# EAGLE design mindspy (EAGLE 6.4)
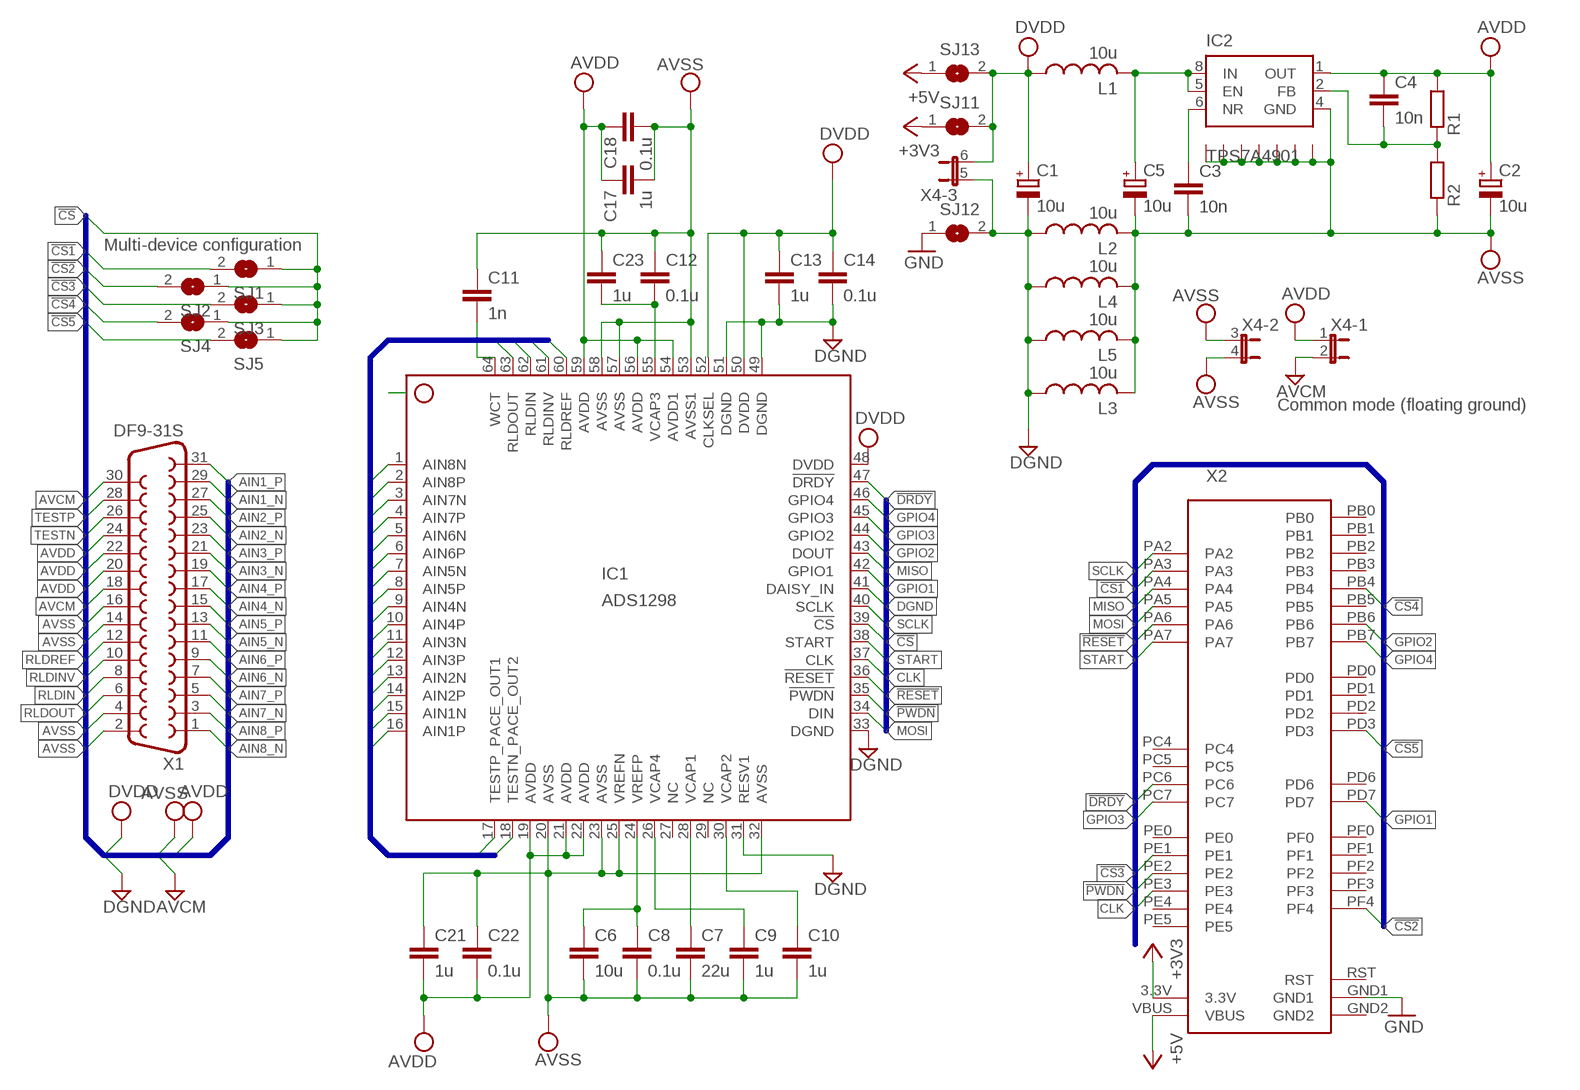
[diagram p0: schematic, sheet 1]

## Parts
C1  10u  CPOL-EUSMCA  [SMC_A]
C2  10u  CPOL-EUSMCA  [SMC_A]
C3  10n  C-EUC0603  [C0603]
C4  10n  C-EUC0603  [C0603]
C5  10u  CPOL-EUSMCA  [SMC_A]
C6  10u  C-EUC0805  [C0805]
C7  22u  C-EUC0805  [C0805]
C8  0.1u  C-EUC0402  [C0402]
C9  1u  C-EUC0402  [C0402]
C10  1u  C-EUC0402  [C0402]
C11  1n  C-EUC0402  [C0402]
C12  0.1u  C-EUC0402  [C0402]
C13  1u  C-EUC0402  [C0402]
C14  0.1u  C-EUC0402  [C0402]
C17  1u  C-EUC0402  [C0402]
C18  0.1u  C-EUC0402  [C0402]
C21  1u  C-EUC0402  [C0402]
C22  0.1u  C-EUC0402  [C0402]
C23  1u  C-EUC0402  [C0402]
IC1  ADS1298  [HTQFP-64-PAP]
IC2  TPS7A4901  [MSOP08]
L1  10u  L1210  [L1210K]
L2  10u  L1210  [L1210K]
L3  10u  L1210  [L1210K]
L4  10u  L1210  [L1210K]
L5  10u  L1210  [L1210K]
R1  R-EU_R0402  [R0402]
R2  R-EU_R0402  [R0402]
SJ1  SJ  [SJ]
SJ2  SJ  [SJ]
SJ3  SJ  [SJ]
SJ4  SJ  [SJ]
SJ5  SJ  [SJ]
SJ11  SJ  [SJ]
SJ12  SJ  [SJ]
SJ13  SJ  [SJ]
X1  DF9-31S  [DF9-31S]
X2  STELLARIS-LAUNCHPADSTELLARIS-LAUNCHPAD  [LAUNCHPAD-XL]
X4  JP3QE  [JP3Q]

## Nets
!CS: IC1.39(!CS) SJ1.1 SJ2.1 SJ3.1 SJ4.1 SJ5.1
!CS1: SJ1.2 X2.PA3
!CS2: SJ2.2 X2.PF4
!CS3: SJ3.2 X2.PE1
!CS4: SJ4.2 X2.PB4
!CS5: SJ5.2 X2.PD3
!DRDY: IC1.47(!DRDY) X2.PC6
!PWDN: IC1.35(!PWDN) X2.PE2
!RESET: IC1.36(!RESET) X2.PA6
+3V3: SJ11.1 X2.3.3V
+5V: SJ13.1 X2.VBUS
AIN1_N: IC1.15(AIN1N) X1.29
AIN1_P: IC1.16(AIN1P) X1.31
AIN2_N: IC1.13(AIN2N) X1.25
AIN2_P: IC1.14(AIN2P) X1.27
AIN3_N: IC1.11(AIN3N) X1.21
AIN3_P: IC1.12(AIN3P) X1.23
AIN4_N: IC1.9(AIN4N) X1.17
AIN4_P: IC1.10(AIN4P) X1.19
AIN5_N: IC1.7(AIN5N) X1.13
AIN5_P: IC1.8(AIN5P) X1.15
AIN6_N: IC1.5(AIN6N) X1.9
AIN6_P: IC1.6(AIN6P) X1.11
AIN7_N: IC1.3(AIN7N) X1.5
AIN7_P: IC1.4(AIN7P) X1.7
AIN8_N: IC1.1(AIN8N) X1.1
AIN8_P: IC1.2(AIN8P) X1.3
AVCM: X1.18 X1.30 X4.2
AVDD: C2.+ C4.1 C17.1 C18.1 C21.2 C22.2 IC1.19(AVDD) IC1.21(AVDD) IC1.22(AVDD) IC1.54(AVDD1) IC1.56(AVDD) IC1.59(AVDD) IC2.1(OUT) R1.2 X1.20 X1.22 X1.24 X4.1
AVSS: C2.- C3.2 C5.- C6.2 C7.2 C8.2 C9.2 C10.2 C11.1 C12.1 C17.2 C18.2 C21.1 C22.1 C23.1 IC1.20(AVSS) IC1.23(AVSS) IC1.25(VREFN) IC1.32(AVSS) IC1.53(AVSS1) IC1.57(AVSS) IC1.58(AVSS) IC2.4(GND) IC2.NC@0(GND) IC2.NC@1(GND) IC2.NC@2(GND) IC2.NC@3(GND) IC2.NC@4(GND) IC2.PWR@1(GND) IC2.PWR@2(GND) L2.2 L3.2 L4.2 L5.2 R2.1 X1.2 X1.4 X1.14 X1.16 X4.3 X4.4
CLK: IC1.37(CLK) X2.PE3
DGND: C1.- C13.2 C14.2 IC1.31(RESV1) IC1.33(DGND) IC1.41(DAISY_IN) IC1.49(DGND) IC1.51(DGND) L2.1 L3.1 L4.1 L5.1 SJ12.2 X4.5
DVDD: C1.+ C13.1 C14.1 IC1.48(DVDD) IC1.50(DVDD) IC1.52(CLKSEL) L1.1 SJ11.2 SJ13.2 X4.6
GND: SJ12.1 X2.GND1
GPIO1: IC1.42(GPIO1) X2.PD7
GPIO2: IC1.44(GPIO2) X2.PB6
GPIO3: IC1.45(GPIO3) X2.PC7
GPIO4: IC1.46(GPIO4) X2.PB7
MISO: IC1.43(DOUT) X2.PA4
MOSI: IC1.34(DIN) X2.PA5
N$1: C6.1 C8.1 IC1.24(VREFP)
N$2: C7.1 IC1.28(VCAP1)
N$3: C3.1 IC2.6(NR)
N$4: C9.1 IC1.26(VCAP4)
N$5: C10.1 IC1.30(VCAP2)
N$6: C12.2 C23.2 IC1.55(VCAP3)
N$7: C11.2 IC1.64(WCT)
N$19: C4.2 IC2.2(FB) R1.1 R2.2
N$22: C5.+ IC2.5(EN) IC2.8(IN) L1.2
RLDIN: IC1.62(RLDIN) X1.8
RLDINV: IC1.61(RLDINV) X1.10
RLDOUT: IC1.63(RLDOUT) X1.6
RLDREF: IC1.60(RLDREF) X1.12
SCLK: IC1.40(SCLK) X2.PA2
START: IC1.38(START) X2.PA7
TESTN: IC1.18(TESTN_PACE_OUT2) X1.26
TESTP: IC1.17(TESTP_PACE_OUT1) X1.28
Unconnected: IC1.27(NC) IC1.29(NC) X2.PB0 X2.PB1 X2.PB2 X2.PB3 X2.PB5 X2.PC4 X2.PC5 X2.PD0 X2.PD1 X2.PD2 X2.PD6 X2.PE0 X2.PE4 X2.PE5 X2.PF0 X2.PF1 X2.PF2 X2.PF3

## Buses
BUS

## Notes on the sheet
- Multi-device configuration
- Common mode (floating ground)

## Power pins joined to a net without a drawn wire
GND2: X2.GND2
RST: X2.RST

## Library data of the parts
C1 C2 C5 = rcl:CPOL-EU: POLARIZED CAPACITOR, European symbol
C3 C4 C6-C14 C17 C18 C21-C23 = rcl:C-EU: CAPACITOR, European symbol
IC1 = fabhack:ADS1298: Quad/Octal, Simultaneous Sampling, 24-Bit Analog-to-Digital Converters ADS1294 / ADS1298 Source: http://focus.ti.com/lit/ds/symlink/ads1294.pdf; MPN: ADS1294IPAG
IC2 = fabhack:TPS7A49*: Ultralow-Noise, Positive LINEAR REGULATOR, +36V, +150mA WITH 8-PIN PSOP PACKAGING Source: http://www.ti.com/lit/ds/symlink/tps7a4901.pdf
L1-L5 = fabhack:L1210
R1 R2 = rcl:R-EU_: RESISTOR, European symbol
SJ1-SJ5 SJ11-SJ13 = jumper:SJ: SMD solder JUMPER
X1 = con-hirose:DF9-31S: SMD CONNECTOR Source: con-hirose.lbr from Bob Starr <rtzaudio@mindspring.com>; MPN: DF9-31S-1V(32); OC_FARNELL: 1798382; OC_NEWARK: 74R3383
X2 = fabhack:STELLARIS-LAUNCHPAD: Stellaris Launchpad LM4F120 using all header pins to connect to XL booster packs.
X4 = jumper:JP3QE: JUMPER

## Board
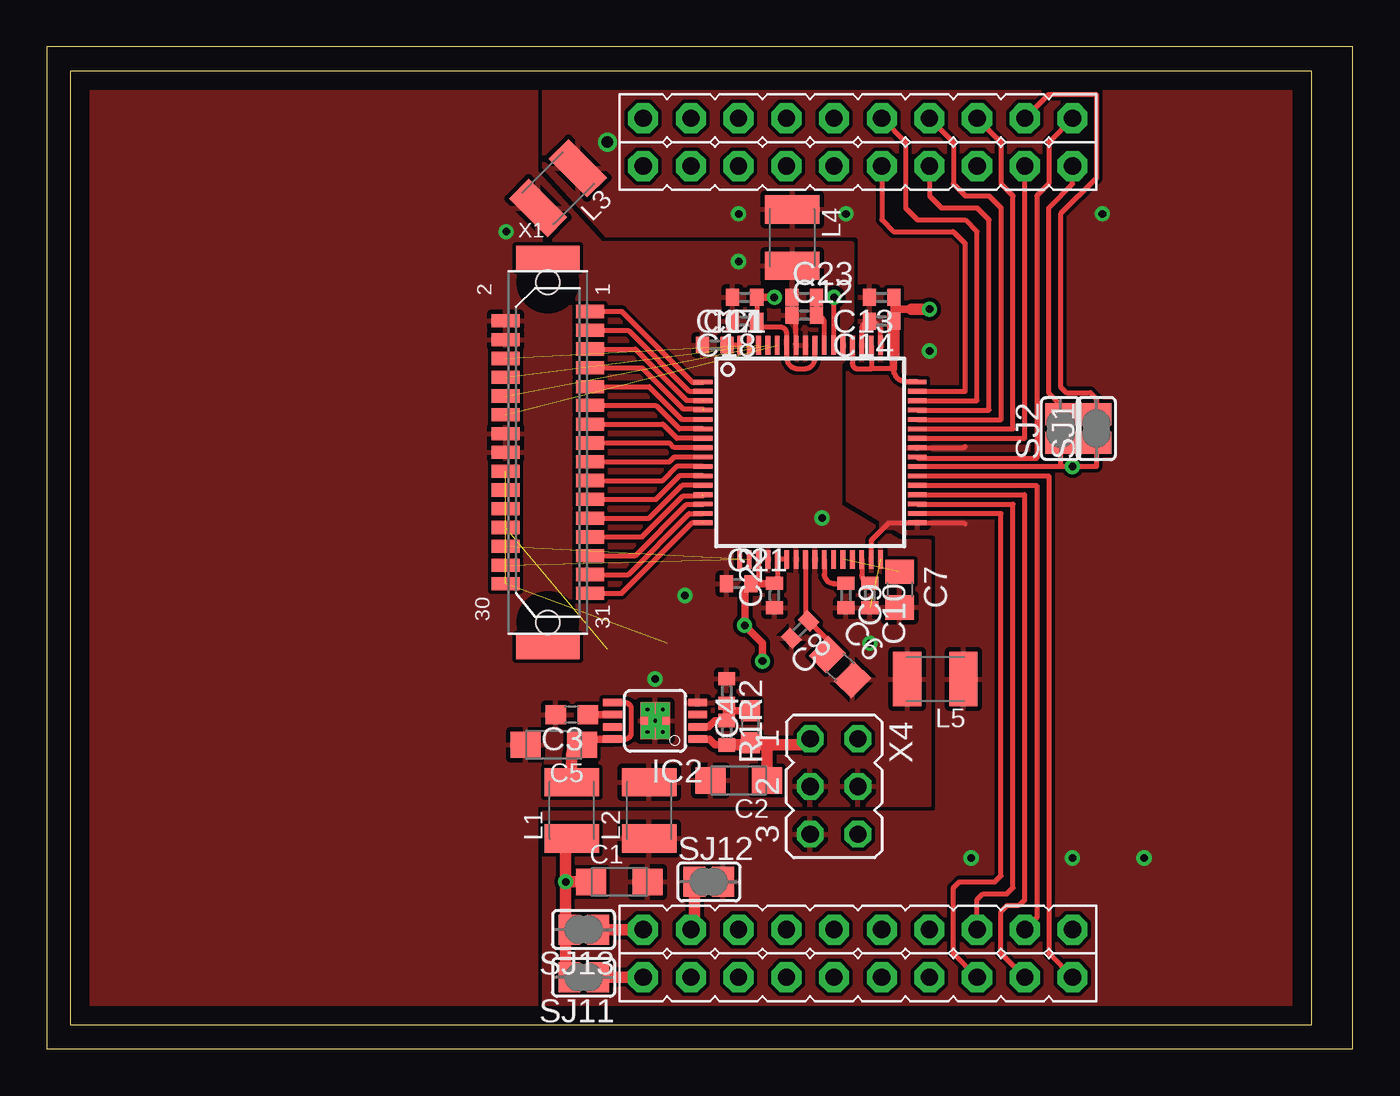
[diagram p1: board, top side]
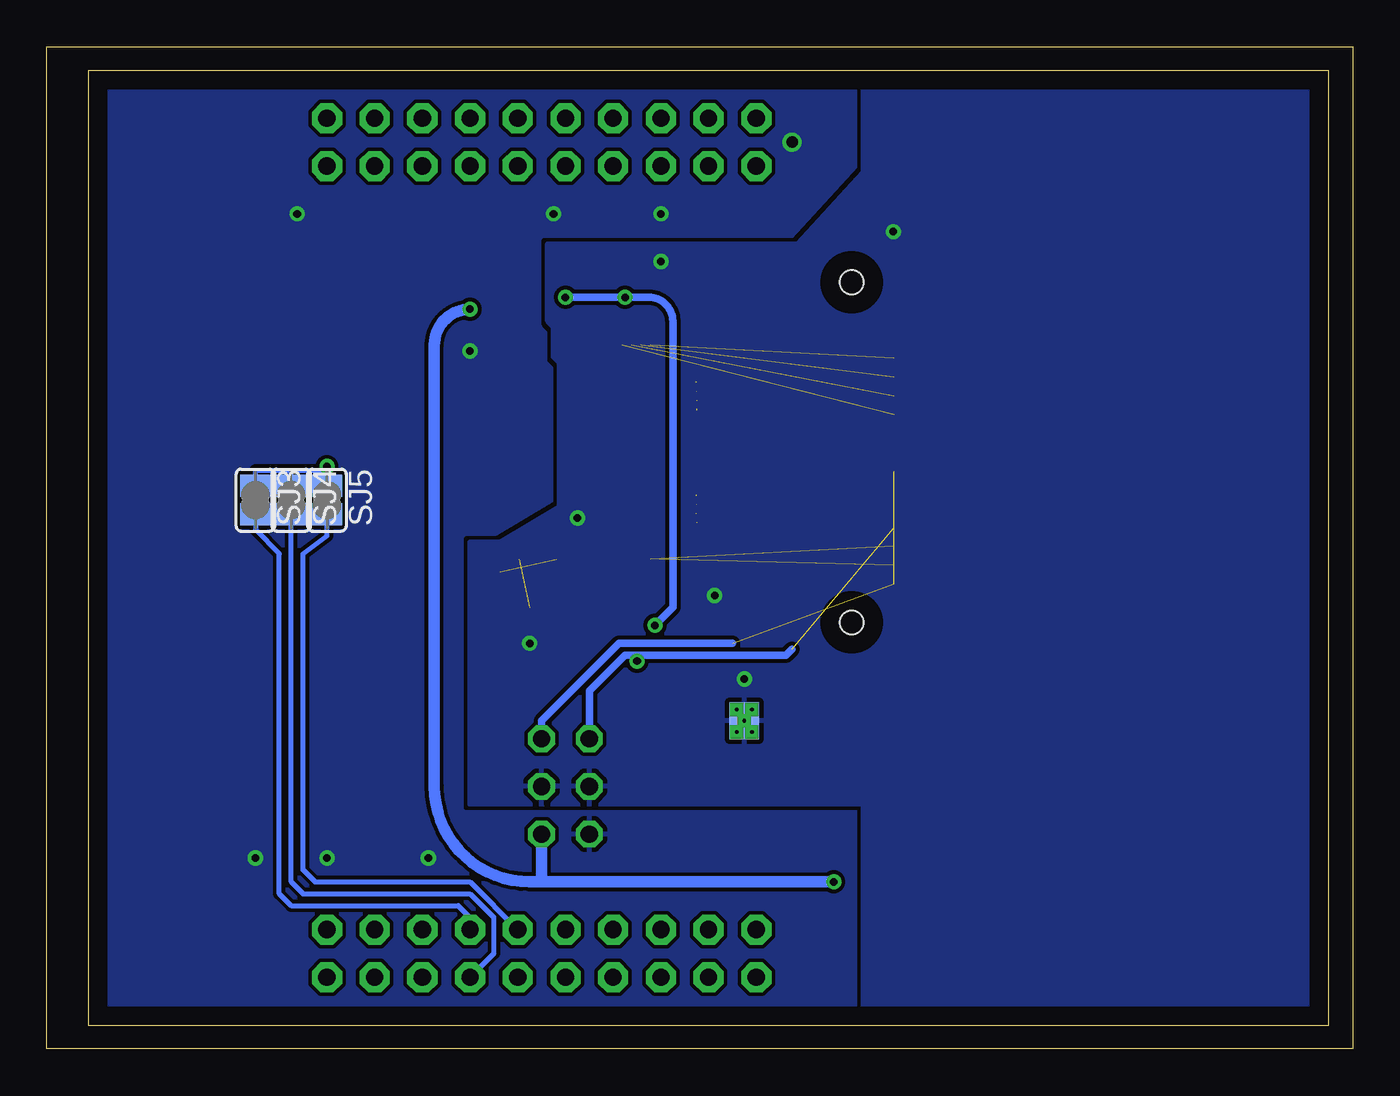
[diagram p2: board, bottom side, seen from below]

Size 69.52 x 53.33 mm. Coordinates in mm from the lower left corner, seen from the top.
Outline: 0,0 69.52,0 69.52,53.33 0,53.33 0,0
Copper layers (1*16): Top 0.035mm / dielectric 1.5mm / Bottom 0.035mm
Design rules "default *": minimum track width 1mil, minimum drill 24mil, track to track 8mil, track to pad 8mil, pad to pad 8mil, via to via 8mil, smd to smd 8mil, copper to edge 40mil, drill to drill 8mil, minimum pad ring 10mil, minimum via ring 8mil, stop-mask expansion 4mil, vias tented up to drill 0mil, thermal gap 10mil

### Footprints (pad centres in the part's own frame; a part is rotated, then mirrored left to right if it is on the bottom)
SMC_A = smd 1.6 x 1.4: + -1.5,0; - 1.5,0
C0603 = smd 1.1 x 1: 1 -0.85,0; 2 0.85,0
C0805 = smd 1.3 x 1.5: 1 -0.95,0; 2 0.95,0
C0402 = smd 0.7 x 0.9: 1 -0.65,0; 2 0.65,0
HTQFP-64-PAP = smd 1 x 0.25: 1 -5.7,3.75; 2 -5.7,3.25; 3 -5.7,2.75; 4 -5.7,2.25; 5 -5.7,1.75; 6 -5.7,1.25; 7 -5.7,0.75; 8 -5.7,0.25; 9 -5.7,-0.25; 10 -5.7,-0.75; 11 -5.7,-1.25; 12 -5.7,-1.75; 13 -5.7,-2.25; 14 -5.7,-2.75; 15 -5.7,-3.25; 16 -5.7,-3.75; 33 5.7,-3.75; 34 5.7,-3.25; 35 5.7,-2.75; 36 5.7,-2.25; 37 5.7,-1.75; 38 5.7,-1.25; 39 5.7,-0.75; 40 5.7,-0.25; 41 5.7,0.25; 42 5.7,0.75; 43 5.7,1.25; 44 5.7,1.75; 45 5.7,2.25; 46 5.7,2.75; 47 5.7,3.25; 48 5.7,3.75 | smd 0.25 x 1: 17 -3.75,-5.7; 18 -3.25,-5.7; 19 -2.75,-5.7; 20 -2.25,-5.7; 21 -1.75,-5.7; 22 -1.25,-5.7; 23 -0.75,-5.7; 24 -0.25,-5.7; 25 0.25,-5.7; 26 0.75,-5.7; 27 1.25,-5.7; 28 1.75,-5.7; 29 2.25,-5.7; 30 2.75,-5.7; 31 3.25,-5.7; 32 3.75,-5.7; 49 3.75,5.7; 50 3.25,5.7; 51 2.75,5.7; 52 2.25,5.7; 53 1.75,5.7; 54 1.25,5.7; 55 0.75,5.7; 56 0.25,5.7; 57 -0.25,5.7; 58 -0.75,5.7; 59 -1.25,5.7; 60 -1.75,5.7; 61 -2.25,5.7; 62 -2.75,5.7; 63 -3.25,5.7; 64 -3.75,5.7
MSOP08 = smd 0.4 x 1: 1 -0.976,-2.263; 2 -0.326,-2.263; 3 0.324,-2.263; 4 0.974,-2.263; 5 0.974,2.262; 6 0.324,2.262; 7 -0.326,2.262; 8 -0.976,2.262 | drill 0.2 square: NC@0 0,0; NC@1 -0.6,-0.4; NC@2 0.6,-0.4; NC@3 -0.6,0.4; NC@4 0.6,0.4 | smd 1.981 x 1.575 bottom: PWR@1 0,0 | smd 1.981 x 1.575: PWR@2 0,0
L1210K = smd 1.5 x 2.9: 1 -1.5,0; 2 1.5,0
R0402 = smd 0.7 x 0.9: 1 -0.65,0; 2 0.65,0
SJ = smd 1.168 x 1.6: 1 -0.762,0; 2 0.762,0
DF9-31S = smd 0.7 x 1.5: 1 -7.5,2.25; 2 -7,-2.25; 3 -6.5,2.25; 4 -6,-2.25; 5 -5.5,2.25; 6 -5,-2.25; 7 -4.5,2.25; 8 -4,-2.25; 9 -3.5,2.25; 10 -3,-2.25; 11 -2.5,2.25; 12 -2,-2.25; 13 -1.5,2.25; 14 -1,-2.25; 15 -0.5,2.25; 16 0,-2.25; 17 0.5,2.25; 18 1,-2.25; 19 1.5,2.25; 20 2,-2.25; 21 2.5,2.25; 22 3,-2.25; 23 3.5,2.25; 24 4,-2.25; 25 4.5,2.25; 26 5,-2.25; 27 5.5,2.25; 28 6,-2.25; 29 6.5,2.25; 30 7,-2.25; 31 7.5,2.25 | smd 1.3 x 3.4: M1 -10.35,0; M2 10.35,0 | hole 1.27: 9.05,0; -9.05,0
LAUNCHPAD-XL = drill 0.914 pad 1.6 octagon: 3.3V 30.48,2.54; GND1 33.02,5.08; GND2 30.48,48.26; PA2 53.34,48.26; PA3 50.8,48.26; PA4 48.26,48.26; PA5 48.26,2.54; PA6 50.8,2.54; PA7 53.34,2.54; PB0 35.56,2.54; PB1 38.1,2.54; PB2 33.02,48.26; PB3 35.56,45.72; PB4 45.72,2.54; PB5 33.02,2.54; PB6 45.72,48.26; PB7 43.18,48.26; PC4 38.1,45.72; PC5 40.64,45.72; PC6 43.18,45.72; PC7 45.72,45.72; PD0 35.56,5.08; PD1 38.1,5.08; PD2 40.64,5.08; PD3 43.18,5.08; PD6 48.26,45.72; PD7 50.8,45.72; PE0 35.56,48.26; PE1 45.72,5.08; PE2 48.26,5.08; PE3 50.8,5.08; PE4 40.64,2.54; PE5 43.18,2.54; PF0 38.1,48.26; PF1 53.34,5.08; PF2 30.48,45.72; PF3 33.02,45.72; PF4 53.34,45.72; RST 40.64,48.26; VBUS 30.48,5.08
JP3Q = drill 0.914 octagon: 1 -2.54,-1.27; 2 -2.54,1.27; 3 0,-1.27; 4 0,1.27; 5 2.54,-1.27; 6 2.54,1.27

### Placement (x,y rotation side)
C1  30.48,8.89 0 top
C2  36.83,14.29 180 top
C3  27.94,17.78 180 top
C4  37.47,17.14 90 top
C5  26.99,16.19 180 top
C6  42.23,20.32 315 top
C7  45.4,24.45 270 top
C8  40.1,22.32 225 top
C9  42.55,24.13 270 top
C10  43.81,24.13 270 top
C11  35.56,37.47 0 top
C12  40.32,39.05 0 top
C13  44.45,40.01 180 top
C14  44.45,38.73 180 top
C17  37.15,40.01 180 top
C18  37.15,38.73 180 top
C21  36.83,24.77 0 top
C22  38.73,24.13 90 top
C23  40.32,40.01 0 top
IC1  40.64,31.75 0 top
IC2  32.38,17.46 90 top
L1  27.94,12.7 90 top
L2  32.07,12.7 90 top
L3  27.21,45.81 225 top
L4  39.69,43.18 270 top
L5  47.31,19.68 180 top
R1  36.2,16.83 270 top
R2  36.2,19.05 270 top
SJ1  55.88,33.02 90 top
SJ2  53.98,33.02 90 top
SJ3  58.42,29.21 270 bottom
SJ4  56.52,29.21 270 bottom
SJ5  54.61,29.21 270 bottom
SJ11  28.57,3.81 180 top
SJ12  35.24,8.89 0 top
SJ13  28.57,6.35 180 top
X1  26.67,31.75 270 top
X2  1.27,1.27 0 top
X4  41.91,13.97 270 top

### Tracks (layer width: path | path; a pad name or v marks a point on that pad's centre or on a via)
!CS  (via drill 0.4)
  Top 0.254: IC1.39 53.98,31 | 53.98,31 v54.61,31 55.88,31 SJ1.1 | SJ2.1 53.98,31
  Bottom 0.254: SJ5.1 54.61,30.8 | 54.61,30.8 v54.61,31 | SJ4.1 56.52,30.8 | 56.52,30.8 54.61,30.8 | SJ3.1 58.42,30.8 56.52,30.8
!CS1
  Top 0.254: X2.PA3 53.34,50.8 55.88,50.8 55.88,46.35 53.98,44.45 53.98,35.24 54.29,34.92 55.56,34.92 55.88,34.61 SJ1.2
!CS2
  Top 0.254: X2.PF4 54.61,46.04 53.34,44.77 53.34,34.92 53.98,34.29 SJ2.2
!CS3
  Bottom 0.254: X2.PE1 46.99,6.99 47.62,7.62 56.52,7.62 57.15,8.26 57.15,26.35 58.42,27.62 SJ3.2
!CS4
  Bottom 0.254: X2.PB4 45.72,5.08 45.72,6.99 46.99,8.26 55.88,8.26 56.52,8.89 SJ4.2
!CS5
  Bottom 0.254: SJ5.2 54.61,27.3 55.88,26.35 55.88,9.53 55.24,8.89 46.99,8.89 X2.PD3
!DRDY
  Top 0.254: IC1.47 48.9,35 48.9,42.86 48.26,43.5 45.09,43.5 44.45,44.13 X2.PC6
!PWDN
  Top 0.254: X2.PE2 49.53,7.94 49.85,8.26 51.12,8.26 51.44,8.57 51.44,29 IC1.35
!RESET
  Top 0.254: X2.PA6 50.8,5.08 50.8,7.3 51.12,7.62 51.75,7.62 52.07,7.94 52.07,29.5 IC1.36
+3V3
  Top 0.61: X2.3.3V SJ11.1
+5V
  Top 0.61: SJ13.1 X2.VBUS
AIN1_N  (1 unrouted)
  Top 0.254: X1.29 30.96,25.25 34.2,28.49 34.92,28.49
AIN1_P  (1 unrouted)
  Top 0.254: X1.31 30.61,24.25 34.38,28.03 34.92,28.03
AIN2_N  (1 unrouted)
  Top 0.254: X1.25 31.69,27.25 33.88,29.44 34.92,29.44
AIN2_P  (1 unrouted)
  Top 0.254: X1.27 31.34,26.25 34.07,28.98 34.92,28.98
AIN3_N
  Top 0.254: X1.21 32.42,29.25 33.67,30.5 IC1.11
AIN3_P
  Top 0.254: X1.23 32.07,28.25 33.82,30 IC1.12
AIN4_N
  Top 0.254: X1.17 33.15,31.25 33.4,31.5 IC1.9
AIN4_P
  Top 0.254: X1.19 32.8,30.25 33.55,31 IC1.10
AIN5_N
  Top 0.254: X1.13 32.8,33.25 33.55,32.5 IC1.7
AIN5_P
  Top 0.254: X1.15 33.15,32.25 33.4,32 IC1.8
AIN6_N
  Top 0.254: X1.9 32.07,35.25 33.82,33.5 IC1.5
AIN6_P
  Top 0.254: X1.11 32.42,34.25 33.67,33 IC1.6
AIN7_N  (1 unrouted)
  Top 0.254: X1.5 31.34,37.25 34.07,34.52 34.92,34.52
AIN7_P  (1 unrouted)
  Top 0.254: X1.7 31.69,36.25 33.88,34.06 34.92,34.06
AIN8_N  (1 unrouted)
  Top 0.254: X1.1 30.61,39.25 34.38,35.47 34.92,35.47
AIN8_P  (1 unrouted)
  Top 0.254: X1.3 30.96,38.25 34.2,35.01 34.92,35.01
AVCM  (2 unrouted)
  Bottom 0.406: 33.02,21.59 39.05,21.59 43.18,17.46 X4.2
AVDD  (via drill 0.4)  (3 unrouted)
  Top 0.254: IC1.59 39.39,36.81 arc90 40.01,36.2 40.32,36.2 arc90 40.89,36.76 IC1.56 | IC1.59 39.39,37.76 | IC1.59 39.39,38.08 arc90 39.05,38.42 38.12,38.42 C18.1 C17.1 | IC1.22 IC1.21 38.89,24.93 C22.2 | IC1.19 37.89,24.98 38.1,24.77 | IC1.54 41.91,37.47 v41.91,40.01
  Top 0.406: IC2.1 35.27,16.49 35.58,16.18 R1.2 | C17.1 v38.73,40.01 arc-90 38.75,39.99 | v38.1,20.64 38.1,21.59 v37.15,22.54 37.16,22.54 37.16,24.45 C21.2 38.1,24.77 38.72,24.77 C22.2
  Top 0.61: R1.2 37.58,16.18 | 38.33,16.18 C2.+ | 38.33,16.18 40.31,16.18 arc90 X4.1 | 38.33,16.18 37.58,16.18 | 37.58,16.18 arc-90 C4.1
  Bottom 0.406: X4.1 40.64,19.05 38.73,20.95 38.1,20.95 | v41.91,40.01 v38.73,40.01 37.47,40.01 arc90 36.2,38.73 36.2,23.5 v37.15,22.54 | 38.1,20.95 30.16,20.95 29.84,21.27 | v38.1,20.64 38.1,20.95
AVSS  (via drill 0.4 pad 0.61)  (1 unrouted)
  Top 0.254: IC1.58 39.89,38.84 C12.1
  other vias: 24.45,43.5 33.97,24.13 32.38,19.68 36.83,41.91 43.81,21.59 41.27,28.26
  pour Top: 1.59,51.75 1.59,1.59 26.04,1.59 26.04,13.02 46.99,13.02 46.99,26.99 45.4,26.99 42.23,28.89 42.23,36.51 42.55,36.83 42.55,38.42 42.86,38.73 42.86,42.86 29.53,42.86 26.04,46.67 26.04,51.75
  pour Bottom: 1.59,51.75 1.59,1.59 26.04,1.59 26.04,13.02 46.99,13.02 46.99,26.99 45.4,26.99 42.23,28.89 42.23,36.51 42.55,36.83 42.55,38.42 42.86,38.73 42.86,42.86 29.53,42.86 26.04,46.67 26.04,51.75
CLK
  Top 0.254: IC1.37 52.7,30 52.7,6.99 X2.PE3
DGND  (via drill 0.4 pad 0.61, 0.61 pad 0.61)
  Top 0.254: IC1.41 48.83,32 48.9,32.07 | 48.9,27.94 48.84,28 IC1.33 44.83,28 43.89,27.06 IC1.31 | IC1.51 43.39,38.33 arc-90 C14.2 arc-90 44.39,38.15 IC1.49
  other vias: 36.83,44.45 42.55,44.45 54.61,10.16 46.99,37.15 29.84,48.26 49.21,10.16 58.42,10.16 56.2,44.45
  pour Top (rank 2): 23.18,51.75 23.18,1.59 66.99,1.59 66.99,51.75
  pour Bottom (rank 2): 23.18,51.75 23.18,1.59 66.99,1.59 66.99,51.75
DVDD  (via drill 0.4, 0.4 pad 0.61)
  Top 0.254: IC1.50 43.89,36.2 | 43.89,36.2 45.09,36.2 arc90 45.78,35.5 IC1.48 | IC1.52 42.89,36.48 arc90 43.18,36.2 43.89,36.2
  Top 0.406: C13.1 45.1,39.37 | 45.1,39.37 C14.1 | 46.04,39.37 45.1,39.37 | 45.09,36.83 45.09,36.2
  Top 0.61: v46.99,39.37 46.04,39.37 | C14.1 45.1,36.84 45.09,36.83 | v27.62,8.89 C1.+ | 27.62,6.35 27.62,4 SJ11.2 | 27.62,6.35 v27.62,8.89 | SJ13.2 27.62,6.35 | v27.62,8.89 27.62,10.88 L1.1
  Bottom 0.61: v46.99,39.37 arc-90 48.9,37.47 48.9,13.97 arc-90 43.81,8.89 43.18,8.89 | 43.18,8.89 v27.62,8.89 | 43.18,8.89 X4.6
GND
  Top 0.61: SJ12.1 34.48,6.54 X2.GND1
GPIO1
  Top 0.254: IC1.42 52.07,32.5 X2.PD7
GPIO2
  Top 0.254: IC1.44 50.8,33.5 50.8,44.77 50.16,45.4 48.9,45.4 48.26,46.04 48.26,48.26 X2.PB6
GPIO3
  Top 0.254: IC1.45 50.16,34 50.16,44.13 49.53,44.77 47.62,44.77 46.99,45.4 X2.PC7
GPIO4
  Top 0.254: IC1.46 49.53,34.5 49.53,43.5 48.9,44.13 46.35,44.13 45.72,44.77 45.72,48.26 X2.PB7
MISO
  Top 0.254: IC1.43 51.44,33 51.44,45.4 50.8,46.04 50.8,48.26 X2.PA4
MOSI
  Top 0.254: X2.PA5 48.26,5.08 48.26,8.57 48.58,8.89 50.48,8.89 50.8,9.21 50.8,28.5 IC1.34
N$1
  Top 0.254: IC1.24 40.39,22.95 C8.1 41.56,21.78 C6.1
N$2  (1 unrouted)
N$3
  Top 0.406: IC2.6 C3.1
N$4
  Top 0.254: IC1.26 41.39,25.29 arc90 41.91,24.77 42.53,24.77 arc90 C9.1
N$5
  Top 0.254: IC1.30 43.39,25.2 arc90 C10.1
N$6
  Top 0.254: C23.2 C12.2 arc-90 41.39,38.63 IC1.55
N$7
  Top 0.254: IC1.64 36.88,37.47 C11.2
N$19
  Top 0.406: IC2.2 35.23,17.14 35.58,17.48 R1.1 | R1.1 R2.2 | C4.2 36.2,18 R1.1
N$22
  Top 0.254: IC2.5 30.78,18.44 arc-90 31.11,18.1 31.11,16.83 arc-90 30.77,16.49 IC2.8
  Top 0.406: IC2.8 28.78,16.49 C5.+
  Top 0.61: L1.2 27.94,15.64 arc-90 C5.+
RLDIN  (1 unrouted)
RLDINV  (1 unrouted)
RLDOUT  (1 unrouted)
RLDREF  (1 unrouted)
SCLK
  Top 0.254: X2.PA2 53.34,48.26 53.34,46.04 52.7,45.4 52.7,31.43 46.41,31.43 IC1.40
START
  Top 0.254: IC1.38 53.34,30.5 53.34,5.08 X2.PA7
TESTN  (1 unrouted)
TESTP  (1 unrouted)